# EAGLE design Sound_Sensor_Card (EAGLE 6.4)

## Sheet 1 of 2
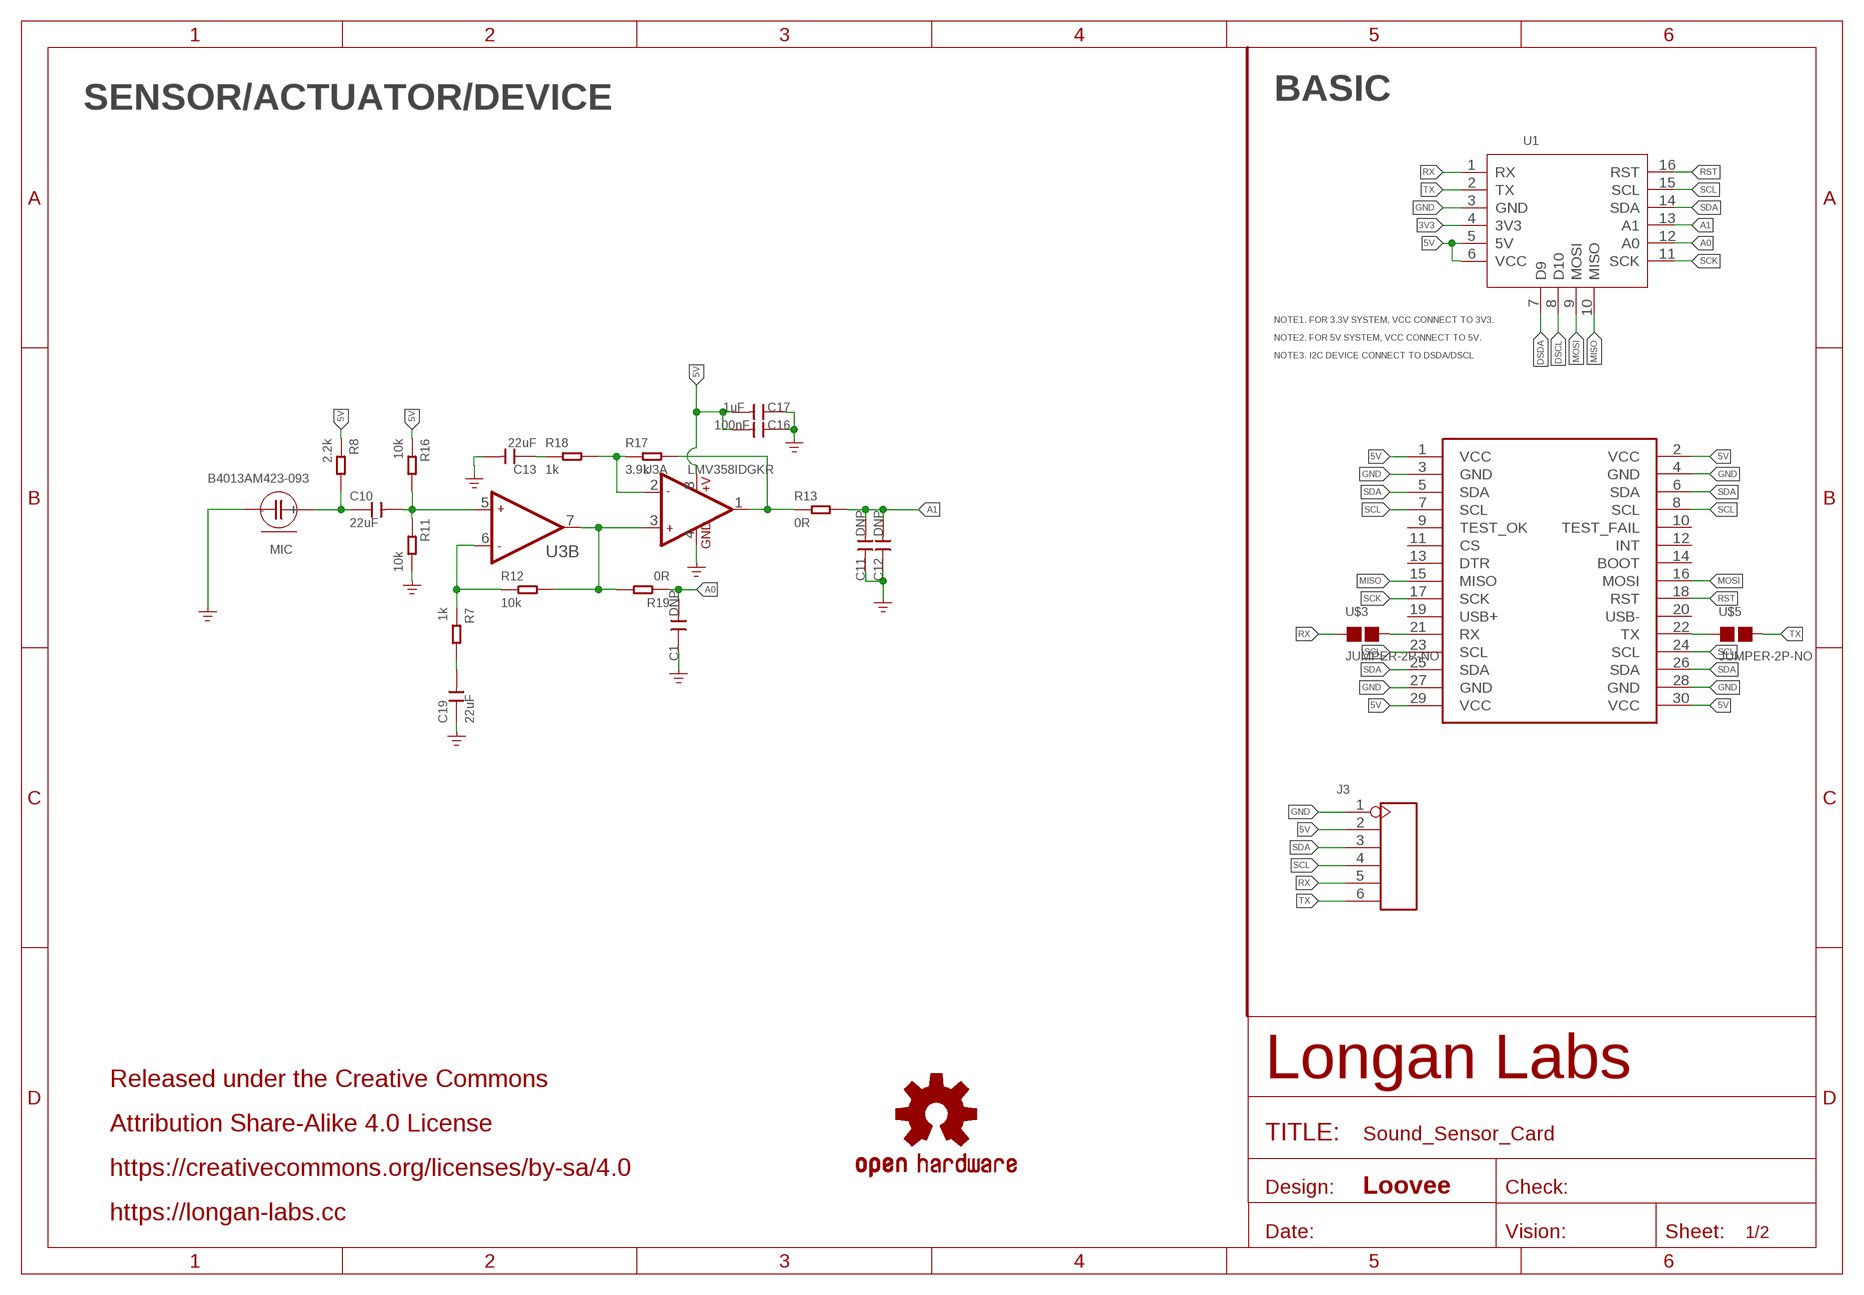
[diagram p0: schematic, sheet 1]

### Parts
C1  DNP  CAP-0603  [C0603]
C10  22uF  CAP-0603  [C0603]
C11  DNP  CAP-0603  [C0603]
C12  DNP  CAP-0603  [C0603]
C13  22uF  CAP-0603  [C0603]
C16  100nF  CAP-0603  [C0603]
C17  1uF  CAP-0603  [C0603]
C19  22uF  CAP-0603  [C0603]
J3  HEADER-6P-55/35MIL  [H6-2.54]
LOGO2  OSHW-LOGOS  [OSHW-LOGO-S]
MIC  B4013AM423-093  MICROPHONE-2P-B4013AM423-093  [MIC2P-SMD-4X4X1.3MM]
MOUDLE1  MOUDLE-2X15P-2.54'BOARD'  [MOUDLE-2X15P-2.54]
R7  1k  RES-0603  [R0603]
R8  2.2k  RES-0603  [R0603]
R11  10k  RES-0603  [R0603]
R12  10k  RES-0603  [R0603]
R13  0R  RES-0603  [R0603]
R16  10k  RES-0603  [R0603]
R17  3.9k  RES-0603  [R0603]
R18  1k  RES-0603  [R0603]
R19  0R  RES-0603  [R0603]
U1  MOUDLE-CARDS  [16P-2.0-CARDS]
U3  LMV358IDGKR  AMPLIFIER-LMV358'DGK'  [MSOP8-0.65-3X3MM]
U$3  JUMPER-2P-NO  [2P-SMD-NO]
U$5  JUMPER-2P-NO  [2P-SMD-NO]

### Nets
3V3: U1.4(3V3)
5V: C16.2 C17.2 J3.2 MOUDLE1.1(VCC) MOUDLE1.2(VCC) MOUDLE1.29(VCC) MOUDLE1.30(VCC) R8.1 R16.1 U1.5(5V) U1.6(VCC) U3.8(A:+V)
A0: C1.2 R19.1 U1.12(A0)
A1: C11.2 C12.2 R13.2 U1.13(A1)
DSCL: U1.8(D10)
DSDA: U1.7(D9)
GND: C1.1 C11.1 C12.1 C13.2 C16.1 C17.1 C19.1 J3.1 MIC.- MIC.-1(-) MIC.-2(-) MIC.-3(-) MOUDLE1.3(GND) MOUDLE1.4(GND) MOUDLE1.27(GND) MOUDLE1.28(GND) R11.2 U1.3(GND) U3.4(A:GND) ; supply symbol labelled GND_POWER
MISO: MOUDLE1.15(MISO) U1.10(MISO)
MOSI: MOUDLE1.16(MOSI) U1.9(MOSI)
N$1: MOUDLE1.21(RX) U$3.2
N$2: MOUDLE1.22(TX) U$5.1
N$3: C10.1 MIC.+ R8.2
N$4: C10.2 R11.1 R16.2 U3.5(B:+IN2)
N$5: R12.2 R19.2 U3.3(A:+IN1) U3.7(B:OUT2)
N$6: R7.1 R12.1 U3.6(B:-IN2)
N$7: R13.1 R17.2 U3.1(A:OUT1)
N$10: C19.2 R7.2
N$11: R17.1 R18.2 U3.2(A:-IN1)
N$12: C13.1 R18.1
RST: MOUDLE1.18(RST) U1.16(RST)
RX: J3.5 U1.1(RX) U$3.1
SCK: MOUDLE1.17(SCK) U1.11(SCK)
SCL: J3.4 MOUDLE1.7(SCL) MOUDLE1.8(SCL) MOUDLE1.23(SCL) MOUDLE1.24(SCL) U1.15(SCL)
SDA: J3.3 MOUDLE1.5(SDA) MOUDLE1.6(SDA) MOUDLE1.25(SDA) MOUDLE1.26(SDA) U1.14(SDA)
TX: J3.6 U1.2(TX) U$5.2
Unconnected: MOUDLE1.9(TEST_OK) MOUDLE1.10(TEST_FAIL) MOUDLE1.11(CS) MOUDLE1.12(INT) MOUDLE1.13(DTR) MOUDLE1.14(BOOT) MOUDLE1.19(USB+) MOUDLE1.20(USB-)

### Notes on the sheet
- SENSOR/ACTUATOR/DEVICE | BASIC
- NOTE1. FOR 3.3V SYSTEM, VCC CONNECT TO 3V3.
- NOTE2. FOR 5V SYSTEM, VCC CONNECT TO 5V.
- NOTE3. I2C DEVICE CONNECT TO DSDA/DSCL
- Released under the Creative Commons
- Attribution Share-Alike 4.0 License
- https://creativecommons.org/licenses/by-sa/4.0
- Loovee
- https://longan-labs.cc

## Sheet 2 of 2

## Library data of the parts
C1 C10-C13 C16 C17 C19 = Discrete-new:CAP: Ceramic Capacitors
J3 = Connector-new:HEADER-6P
LOGO2 = SparkFun-Aesthetics:OSHW-LOGO: Open-Source Hardware (OSHW) Logo This logo indicates the piece of hardware it is found on incorporates a OSHW license and/or adheres to the definition of open source hardware found here: http://freedomdefined.org/OSHW
MIC = Discrete-new:MICROPHONE-2P
MOUDLE1 = Longan-moudle:MOUDLE-2X15P-2.54
R7 R8 R11-R13 R16-R19 = Discrete-new:RES
U1 = MOUDLE-CARDS:MOUDLE-CARDS
U3 = IC-new:AMPLIFIER-LMV358: SOIC-8:310020002;MSOP-8:310020007
U$3 U$5 = Discrete-new:JUMPER-2P-NO

## Board
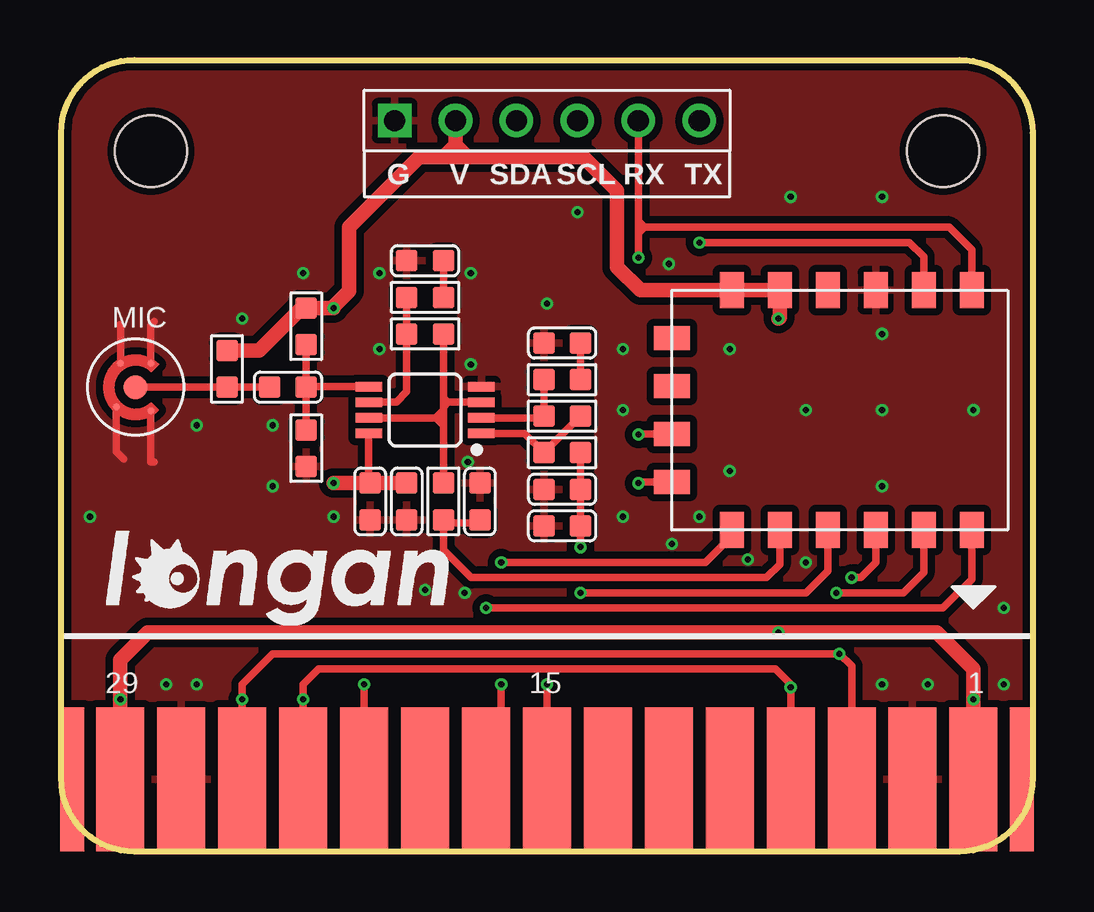
[diagram p1: board, top side]
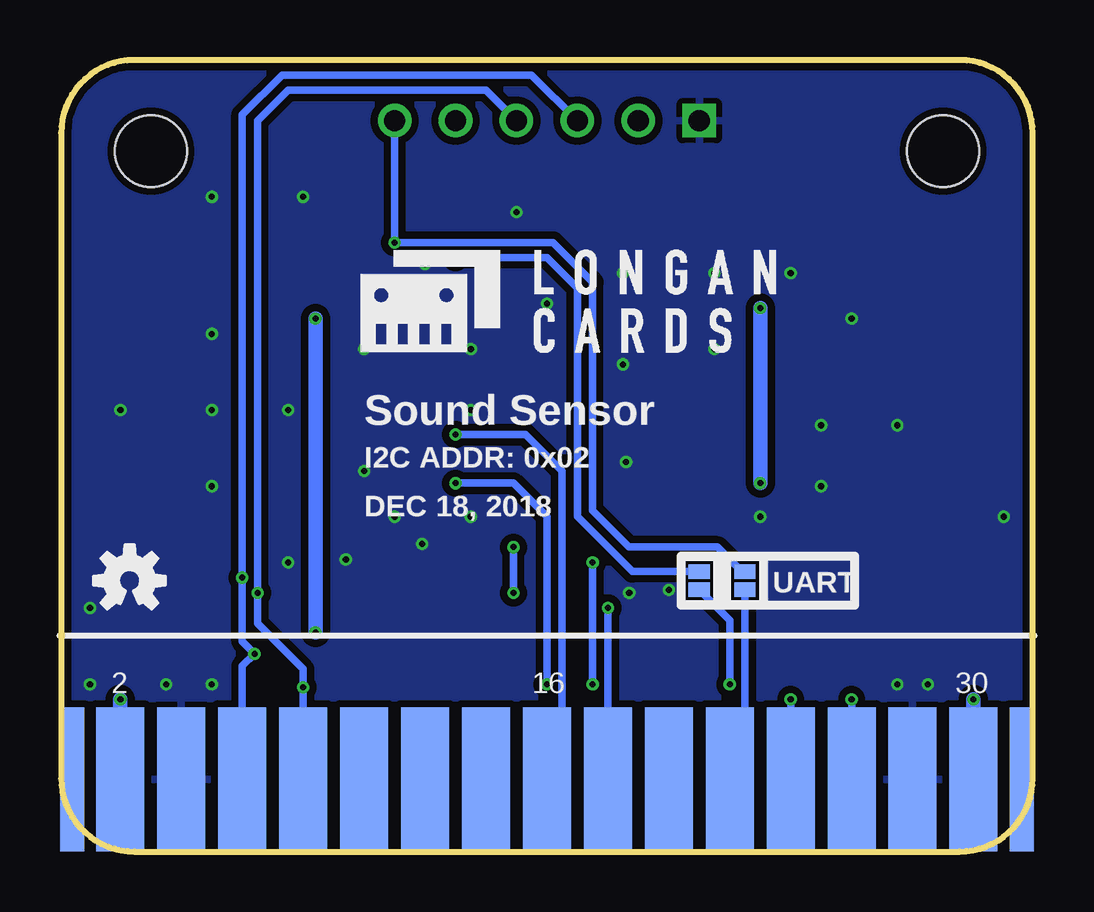
[diagram p2: board, bottom side, seen from below]

Size 40.5 x 33 mm. Coordinates in mm from the lower left corner, seen from the top.
Copper layers (1*16): Top 0.035mm / dielectric 1.5mm / Bottom 0.035mm
Design rules "SeeedStudio_2layer_DRU_no_angle_20140221": minimum track width 1mil, minimum drill 10mil, track to track 6mil, track to pad 6mil, pad to pad 6mil, via to via 6mil, smd to smd 0mil, copper to edge 10mil, drill to drill 10mil, minimum pad ring 4mil, minimum via ring 4mil, stop-mask expansion 2mil, vias tented up to drill 25mil, thermal gap 10mil

### Footprints (pad centres in the part's own frame; a part is rotated, then mirrored left to right if it is on the bottom)
C0603 = smd 0.889 x 0.889: 1 0,0.762; 2 0,-0.762
H6-2.54 = drill 0.889 pad 1.397 square: 1 0,6.35 | drill 0.889 pad 1.397: 2 0,3.81; 3 0,1.27; 4 0,-1.27; 5 0,-3.81; 6 0,-6.35
MIC2P-SMD-4X4X1.3MM = smd 1 x 1: + 0,0 | smd 0.3 x 0.3: - -1.143,-0.254; -1 -0.254,-1.143; -2 1.143,0; -3 0.254,1.143
MOUDLE-2X15P-2.54 = smd 2 x 6: 1 17.78,-13.492; 3 15.24,-13.492; 5 12.7,-13.492; 7 10.16,-13.492; 9 7.62,-13.492; 11 5.08,-13.492; 13 2.54,-13.492; 15 0,-13.492; 17 -2.54,-13.492; 19 -5.08,-13.492; 21 -7.62,-13.492; 23 -10.16,-13.492; 25 -12.7,-13.492; 27 -15.24,-13.492; 29 -17.78,-13.492 | smd 2 x 6 bottom: 2 17.78,-13.492; 4 15.24,-13.492; 6 12.7,-13.492; 8 10.16,-13.492; 10 7.62,-13.492; 12 5.08,-13.492; 14 2.54,-13.492; 16 0,-13.492; 18 -2.54,-13.492; 20 -5.08,-13.492; 22 -7.62,-13.492; 24 -10.16,-13.492; 26 -12.7,-13.492; 28 -15.24,-13.492; 30 -17.78,-13.492 | smd 1 x 6: P1 -19.8,-13.492; P4 19.8,-13.492 | smd 1 x 6 bottom: P2 -19.8,-13.492; P3 19.8,-13.492 | hole 3: -16.51,12.7; 16.51,12.7
R0603 = smd 0.889 x 0.889: 1 0,0.762; 2 0,-0.762
16P-2.0-CARDS = smd 1.5 x 1: 1 -5,5; 2 -5,3; 3 -5,1; 4 -5,-1; 5 -5,-3; 6 -5,-5; 11 5,-5; 12 5,-3; 13 5,-1; 14 5,1; 15 5,3; 16 5,5 | smd 1 x 1.5: 7 -3,-7.5; 8 -1,-7.5; 9 1,-7.5; 10 3,-7.5
MSOP8-0.65-3X3MM = smd 1.1 x 0.4: 1 -2.35,0.975; 2 -2.35,0.325; 3 -2.35,-0.325; 4 -2.35,-0.975; 5 2.35,-0.975; 6 2.35,-0.325; 7 2.35,0.325; 8 2.35,0.975
2P-SMD-NO = smd 0.889 x 0.61: 1 0,0.381; 2 0,-0.381

### Placement (x,y rotation side)
C1  17.46,14.6 0 top
C10  9.46,19.36 90 top
C11  20.89,13.58 90 top
C12  20.89,15.1 90 top
C13  20.89,21.2 270 top
C16  14.41,14.6 180 top
C17  12.88,14.6 180 top
C19  15.17,24.63 90 top
J3  20.25,30.47 90 top
LOGO2  37.65,11.29 0 bottom
MIC  3.11,19.36 225 top
MOUDLE1  20.25,16.5 0 top
R7  15.17,23.1 90 top
R8  6.91,20.12 0 top
R11  10.22,16.82 0 top
R12  15.17,21.58 90 top
R13  20.89,16.63 90 top
R16  10.22,21.9 0 top
R17  20.89,18.15 90 top
R18  20.89,19.68 270 top
R19  15.93,14.6 180 top
U1  32.95,18.41 270 top
U3  15.17,18.41 180 top
U$1  [LONGAN-CARDS-MIDDLE]  28.76,20.31 0 bottom
U$2  [LONGAN-SILK-SMALLER]  0.57,8.24 0 top
U$3  13.9,11.29 0 bottom
U$5  11.99,11.29 180 bottom

### Tracks (layer width: path | path; a pad name or v marks a point on that pad's centre or on a via)
5V  (via drill 0.25 pad 0.51)
  Top 0.305: U3.8 12.82,15.42 C17.2 | 10.36,22.66 10.03,22.66
  Top 0.61: v29.9,22.21 29.95,22.26 U1.5 U1.6 24.14,23.41 23.17,24.37 23.17,27.55 21.77,28.95 17.96,28.95 16.95,28.95 | MOUDLE1.30 v2.47,6.34 2.47,7.99 3.61,9.13 v29.9,9.13 36.51,9.13 38.03,7.61 v38.03,6.34 MOUDLE1.2 | R8.1 8.25,20.88 10.03,22.66 | C16.2 C17.2 v11.36,15.36 | R16.1 10.36,22.66 v11.36,22.66 11.36,22.72 11.99,23.36 11.99,26.02 14.92,28.95 15.8,28.95 | 16.95,28.95 16.31,28.95 | 16.31,28.95 15.8,28.95 | J3.2 16.44,29.45 | 16.44,29.45 16.44,29.07 16.31,28.95 | 15.8,28.95 15.93,28.95 16.44,29.45 | 16.44,29.45 16.95,28.95
  Bottom 0.61: v29.9,22.21 v29.9,9.13 | v2.47,6.34 MOUDLE1.30 | v38.03,6.34 MOUDLE1.2 | v11.36,15.36 v11.36,22.66
A0
  Top 0.305: U1.12 29.95,11.98 29.39,11.42 17.07,11.42 15.93,12.56 15.93,13.71 | R19.1 15.93,13.71 | 15.93,13.71 17.33,13.71 C1.2
A1  (via drill 0.25 pad 0.51)
  Top 0.305: R13.2 C12.2 C11.2 v21.65,12.69 | U1.13 31.95,11.69 31.05,10.79 v21.65,10.79
  Bottom 0.305: v21.65,10.79 v21.65,12.69
GND  (via drill 0.25 pad 0.51)
  Top 0.305: MIC.-2 2.3,16.67 2.34,16.63 | 2.34,16.63 2.6,16.37 2.34,16.63 | MIC.-3 3.73,16.25 3.74,16.25 3.87,16.25 | MIC.-1 2.48,21.95 2.47,21.96 | MIC.- 3.73,21.95 3.87,22.09
  other vias: 4.38,6.97 5.64,6.97 1.2,13.96 39.3,6.97 11.36,13.96 8.82,17.77 8.82,15.23 5.64,17.77 13.27,20.95 16.95,16.25 17.07,20.31 17.07,24.12 21.52,26.66 13.27,24.12 7.55,22.21 34.22,6.97 36.12,6.97 23.43,18.41 23.43,20.95 20.25,22.85 23.43,13.96 26.6,13.96 27.87,20.95 27.87,15.87 25.33,24.5 30.41,27.3 34.22,21.58 34.22,18.41 34.22,15.23 38.03,18.41 39.3,10.15 10.09,24.12 34.22,27.3 31.05,18.41 16.82,10.79 15.17,10.91 25.46,12.82 28.63,12.18 31.05,12.05
  pour Bottom (isolate 0.305): -0.07,33.01 40.57,33.01 40.57,-0.01 -0.07,-0.01
  pour Top (isolate 0.305): -0.07,33.01 40.57,33.01 40.57,-0.01 -0.07,-0.01
MISO  (via drill 0.25 pad 0.51)
  Top 0.305: v20.25,6.97 MOUDLE1.15 | U1.10 24.11,15.4 v24.06,15.36
  Bottom 0.305: v20.25,6.97 20.25,13.96 21.65,15.36 v24.06,15.36
MOSI  (via drill 0.25 pad 0.51)
  Top 0.305: U1.9 24.08,17.41 v24.06,17.39
  Bottom 0.305: MOUDLE1.16 19.61,3.64 19.61,15.87 21.14,17.39 v24.06,17.39
N$1  (via drill 0.25 pad 0.51)
  Top 0.305: MOUDLE1.21 v12.63,6.97
  Bottom 0.305: v12.63,6.97 12.63,9.64 U$3.2
N$2
  Bottom 0.305: U$5.1 11.99,3.64 MOUDLE1.22
N$3
  Top 0.305: C10.1 R8.2 MIC.+
N$4
  Top 0.305: R11.1 C10.2 | C10.2 R16.2 | U3.5 10.24,19.38 C10.2
N$5
  Top 0.305: R12.2 15.93,18.91 | 15.93,18.91 15.93,18.79 | 15.93,18.79 15.93,18.53 | 15.93,18.53 15.93,18.41 | 15.93,18.41 15.93,18.15 | 15.93,18.15 15.93,17.77 | 15.93,17.77 R19.2 | U3.3 16.34,18.73 | 16.34,18.73 15.99,18.73 15.93,18.79 | U3.7 15.61,18.08 | 15.61,18.08 15.86,18.08 15.93,18.15 | 15.61,18.08 15.62,18.08 15.93,17.77 | 15.61,18.08 | 15.61,18.08 15.93,18.41 | 16.34,18.73 16.13,18.73 15.93,18.53 | 16.34,18.73 16.12,18.73 15.93,18.91
N$6
  Top 0.305: R7.1 R12.1 14.41,19.17 13.97,18.73 U3.6
N$7
  Top 0.305: U3.1 19.32,17.43 R13.1 R17.2
N$10
  Top 0.305: R7.2 C19.2
N$11
  Top 0.305: U3.2 20.05,18.08 R17.1 R18.2
N$12
  Top 0.305: R18.1 C13.1
RST  (via drill 0.25 pad 0.51)
  Top 0.305: v17.71,10.15 36.76,10.15 37.95,11.34 U1.16
  Bottom 0.305: v17.71,10.15 MOUDLE1.18
RX  (via drill 0.25 pad 0.51)
  Top 0.305: U1.1 37.95,25.09 37.01,26.02 24.31,26.02 | J3.5 24.06,26.28 | 24.06,26.28 24.06,26.15 | 24.06,26.15 24.06,25.77 | 24.06,25.77 v24.06,24.76 | 24.31,26.02 24.19,26.02 24.06,26.15 | 24.31,26.02 24.06,26.28 | 24.31,26.02 24.06,25.77
  Bottom 0.305: U$3.1 16.69,11.67 18.98,13.96 18.98,23.48 20.25,24.76 v24.06,24.76
SCK  (via drill 0.25 pad 0.51)
  Top 0.305: v18.34,6.97 18.34,3.64 MOUDLE1.17 | U1.11 27.95,13.15 26.85,12.05 v18.34,12.05
  Bottom 0.305: v18.34,12.05 v18.34,6.97
SCL  (via drill 0.25 pad 0.51)
  Top 0.305: 29.39,7.61 29.27,7.61 | 29.27,7.61 10.72,7.61 10.09,6.97 v10.09,6.34 MOUDLE1.23 | U1.15 35.95,11.63 35.11,10.79 v32.31,10.79 | 29.27,7.61 29.77,7.61 30.41,6.97 v30.41,6.85 MOUDLE1.8 | MOUDLE1.8 30.41,2.4 30.28,2.28 30.28,2.88 MOUDLE1.8
  Bottom 0.305: v10.09,6.34 MOUDLE1.23 | J3.4 22.79,31.74 31.05,31.74 32.31,30.47 v32.31,10.79 32.31,9.52 30.41,7.61 v30.41,6.85 MOUDLE1.8
SDA  (via drill 0.25 pad 0.51)
  Top 0.305: MOUDLE1.25 v7.55,6.34 7.55,6.97 8.82,8.24 v32.44,8.24 32.95,7.74 MOUDLE1.6 | U1.14 33.95,12.04 33.33,11.42 v32.95,11.42
  Bottom 0.305: v7.55,6.34 MOUDLE1.25 | J3.3 20.89,32.38 31.3,32.38 32.95,30.72 v32.95,11.42 32.95,8.75 v32.44,8.24 32.95,7.74 MOUDLE1.6
TX  (via drill 0.25 pad 0.51)
  Top 0.305: U1.2 35.95,24.8 35.36,25.39 v26.6,25.39
  Bottom 0.305: J3.6 v26.6,25.39 20,25.39 18.34,23.74 18.34,14.21 16.82,12.69 13.14,12.69 12.12,11.67 U$5.2

### Text on the board
tPlace: G | V | SDA | SCL | RX | TX
bPlace: Sound Sensor | I2C ADDR: 0x02 | DEC 18, 2018 | UART